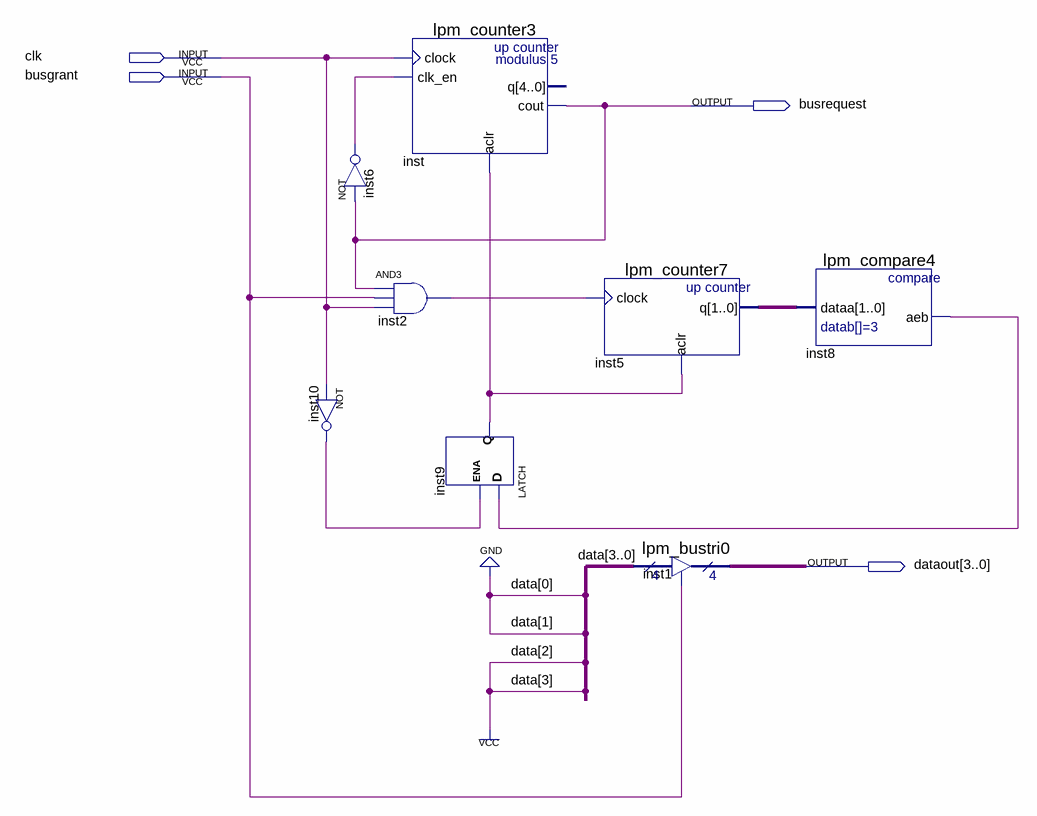
[diagram p0: schematic sheet]
// Quartus schematic master4.bdf as structural Verilog: 8 symbols, 4 pins
module master4 (
  input  clk,
  input  busgrant,
  output busrequest,
  output [3:0] dataout
);

  wire inst2_out, inst6_out, inst8_aeb, inst9_q, inst10_out;
  wire [1:0] inst5_q;

  not inst6 (inst6_out, busrequest);
  not inst10 (inst10_out, clk);
  lpm_counter3 inst (.clock(clk), .clk_en(inst6_out), .aclr(inst9_q), .cout(busrequest));  // open: q
  and inst2 (inst2_out, busrequest, busgrant, clk);
  LATCH inst9 (.D(inst8_aeb), .ENA(inst10_out), .Q(inst9_q));
  lpm_counter7 inst5 (.clock(inst2_out), .aclr(inst9_q), .q(inst5_q));
  lpm_bustri0 inst1 (.enabledt(busgrant), .data(4'b1100), .tridata(dataout));
  lpm_compare4 inst8 (.dataa(inst5_q), .aeb(inst8_aeb));
endmodule
